# Altium schematic sheet INDEX.SchDoc
size 420 x 297 mm; SheetNumber: 1; SheetTotal: 5
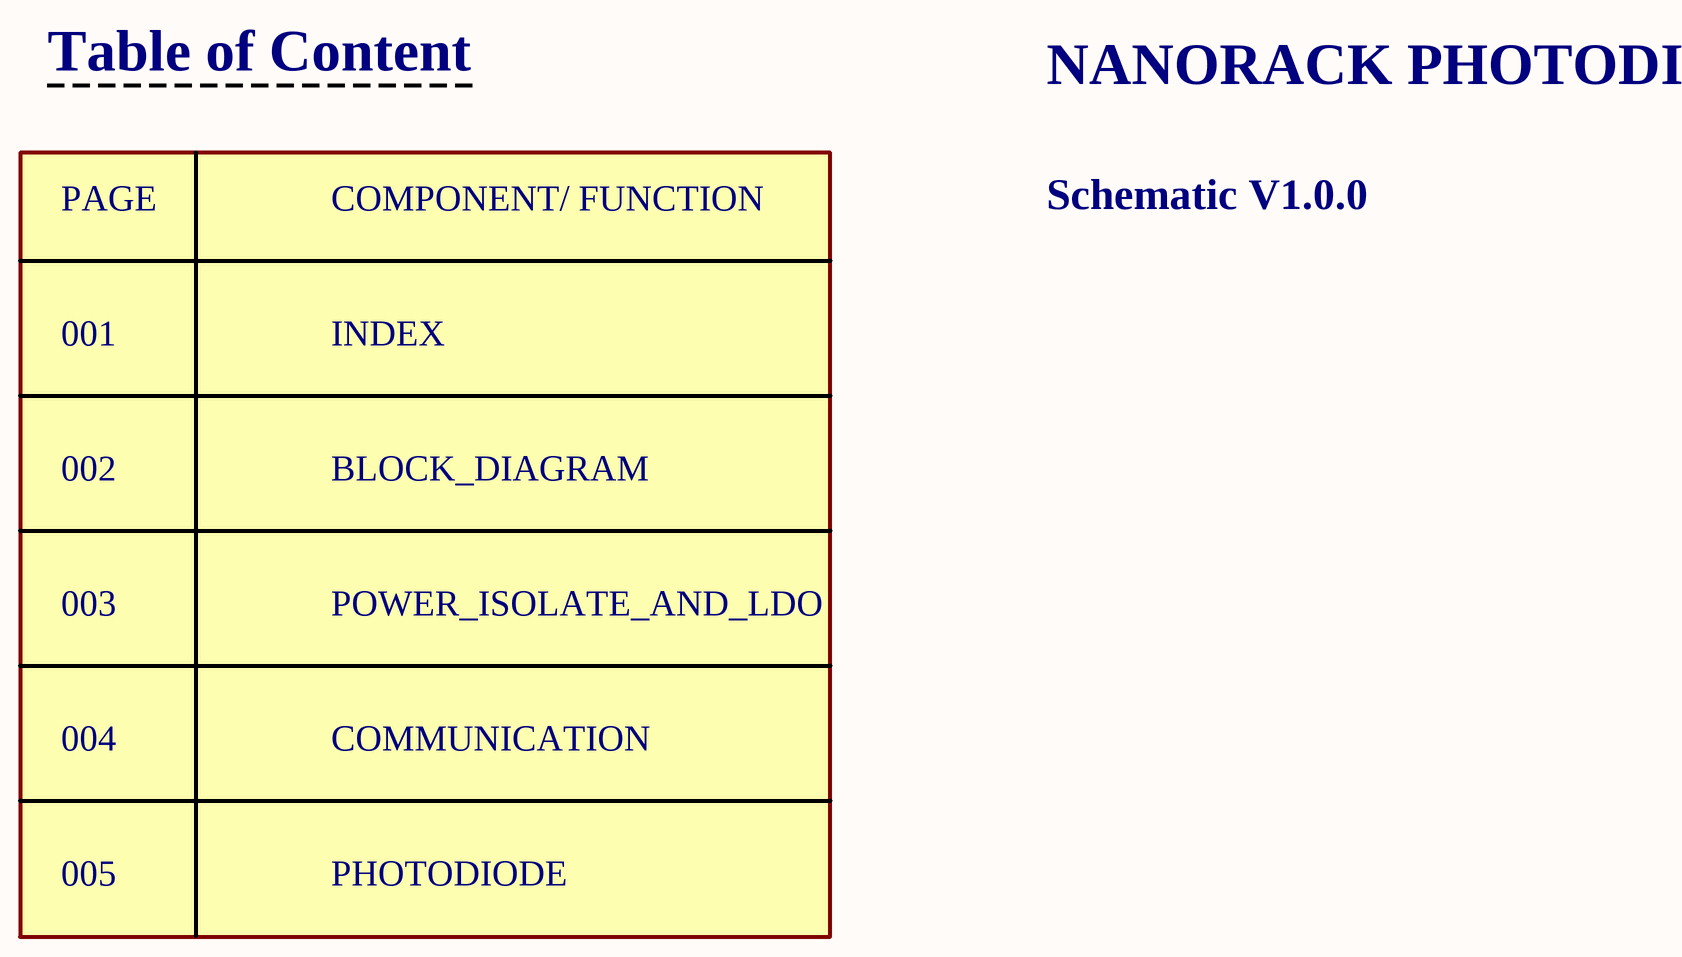
[diagram p0: INDEX.SchDoc]

## Notes on the sheet
- Table of Content
- NANORACK PHOTODIODE
- PAGE
- COMPONENT/ FUNCTION
- Schematic V1.0.0
- 001
- INDEX
- 002
- BLOCK_DIAGRAM
- 003
- POWER_ISOLATE_AND_LDO
- 004
- COMMUNICATION
- 005
- PHOTODIODE
- Project:
- BEE-PC1
- Sub-system:
- Design by:
- Hung Nguyen D.
- Bao Bui Q.
- Sheet title:
- Sheet
- A3
- of
- Checked by:
- Approved by:
- Vu Pham
- Revision:
- Document No:
- V1.0.0
- Size:
- Date: